# Altium schematic sheet llrf_afe_reserve_io.SchDoc: =GlobalProjectName
size 209 x 297 mm; SheetNumber: Лист; SheetTotal: Листов; PageSetup: Record=PageOptions|CenterHorizontal=True|CenterVertical=True|PrintScale=1.00|XCorrection=1.00|YCorrection=1.00|PrintKind=1|BorderSize=5000000|LeftOffset=0|BottomOffset=0|Orientation=2|PaperLength=1000|PaperWidth=1000|Scale=100|PaperSource=15|PrintQuality=1200|MediaType=1|DitherType=10|PaperKind=A3|PrintScaleMode=1; Weight: -; ScaleFactor: -
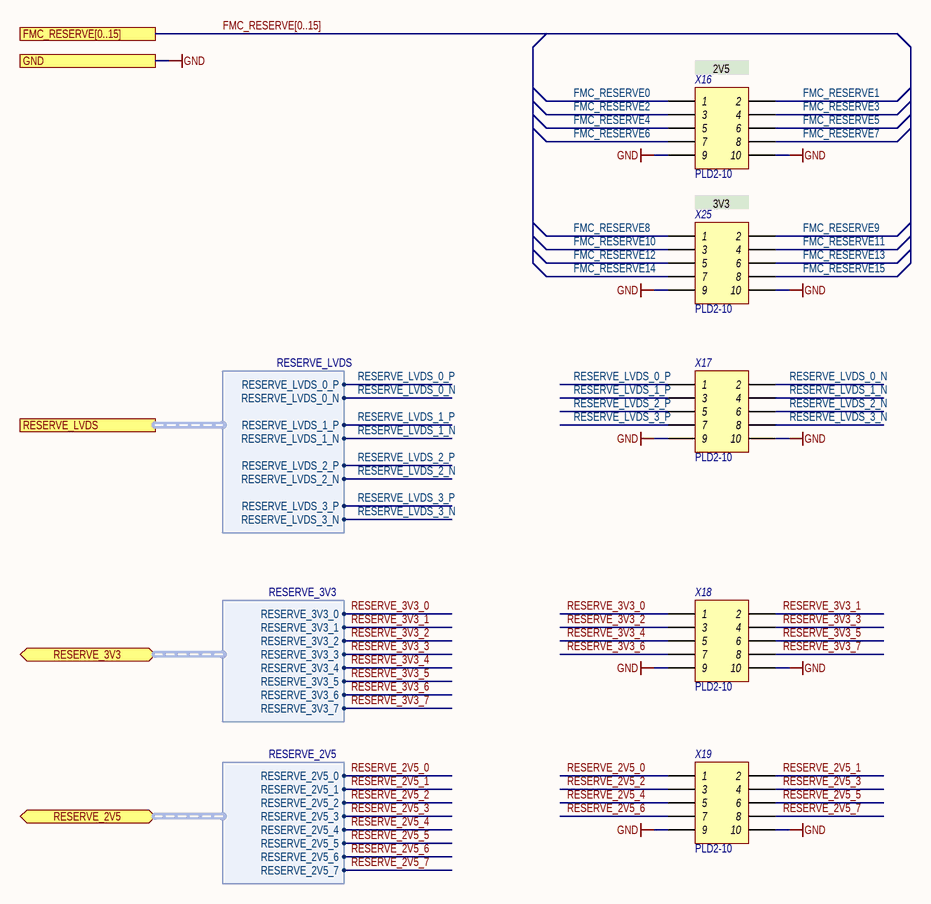
[diagram p0: llrf_afe_reserve_io.SchDoc]

## Parts
X16  Header 2X10  [PLD2-10]  (value not drawn)
X17  Header 2X10  [PLD2-10]  (value not drawn)
X18  Header 2X10  [PLD2-10]  (value not drawn)
X19  Header 2X10  [PLD2-10]  (value not drawn)
X25  Header 2X10  [PLD2-10]  (value not drawn)

## Ports
FMC_RESERVE[0..15], GND, RESERVE_2V5 (bidir, harness RESERVE_2V5), RESERVE_3V3 (bidir, harness RESERVE_3V3), RESERVE_LVDS (harness RESERVE_LVDS)

## Harnesses
RESERVE_LVDS: RESERVE_LVDS_0_P, RESERVE_LVDS_0_N, RESERVE_LVDS_1_P, RESERVE_LVDS_1_N, RESERVE_LVDS_2_P, RESERVE_LVDS_2_N, RESERVE_LVDS_3_P, RESERVE_LVDS_3_N
RESERVE_3V3: RESERVE_3V3_0, RESERVE_3V3_1, RESERVE_3V3_2, RESERVE_3V3_3, RESERVE_3V3_4, RESERVE_3V3_5, RESERVE_3V3_6, RESERVE_3V3_7
RESERVE_2V5: RESERVE_2V5_0, RESERVE_2V5_1, RESERVE_2V5_2, RESERVE_2V5_3, RESERVE_2V5_4, RESERVE_2V5_5, RESERVE_2V5_6, RESERVE_2V5_7

## Nets
GND: X16.9 X16.10 X17.9 X17.10 X18.9 X18.10 X19.9 X19.10 X25.9 X25.10 ; port GND
FMC_RESERVE0: X16.1
FMC_RESERVE1: X16.2
FMC_RESERVE2: X16.3
FMC_RESERVE3: X16.4
FMC_RESERVE4: X16.5
FMC_RESERVE5: X16.6
FMC_RESERVE6: X16.7
FMC_RESERVE7: X16.8
FMC_RESERVE8: X25.1
FMC_RESERVE9: X25.2
FMC_RESERVE10: X25.3
FMC_RESERVE11: X25.4
FMC_RESERVE12: X25.5
FMC_RESERVE13: X25.6
FMC_RESERVE14: X25.7
FMC_RESERVE15: X25.8
RESERVE_2V5_0: X19.1 ; port RESERVE_2V5.RESERVE_2V5_0
RESERVE_2V5_1: X19.2 ; port RESERVE_2V5.RESERVE_2V5_1
RESERVE_2V5_2: X19.3 ; port RESERVE_2V5.RESERVE_2V5_2
RESERVE_2V5_3: X19.4 ; port RESERVE_2V5.RESERVE_2V5_3
RESERVE_2V5_4: X19.5 ; port RESERVE_2V5.RESERVE_2V5_4
RESERVE_2V5_5: X19.6 ; port RESERVE_2V5.RESERVE_2V5_5
RESERVE_2V5_6: X19.7 ; port RESERVE_2V5.RESERVE_2V5_6
RESERVE_2V5_7: X19.8 ; port RESERVE_2V5.RESERVE_2V5_7
RESERVE_3V3_0: X18.1 ; port RESERVE_3V3.RESERVE_3V3_0
RESERVE_3V3_1: X18.2 ; port RESERVE_3V3.RESERVE_3V3_1
RESERVE_3V3_2: X18.3 ; port RESERVE_3V3.RESERVE_3V3_2
RESERVE_3V3_3: X18.4 ; port RESERVE_3V3.RESERVE_3V3_3
RESERVE_3V3_4: X18.5 ; port RESERVE_3V3.RESERVE_3V3_4
RESERVE_3V3_5: X18.6 ; port RESERVE_3V3.RESERVE_3V3_5
RESERVE_3V3_6: X18.7 ; port RESERVE_3V3.RESERVE_3V3_6
RESERVE_3V3_7: X18.8 ; port RESERVE_3V3.RESERVE_3V3_7
RESERVE_LVDS_0_N: X17.2 ; port RESERVE_LVDS.RESERVE_LVDS_0_N
RESERVE_LVDS_0_P: X17.1 ; port RESERVE_LVDS.RESERVE_LVDS_0_P
RESERVE_LVDS_1_N: X17.4 ; port RESERVE_LVDS.RESERVE_LVDS_1_N
RESERVE_LVDS_1_P: X17.3 ; port RESERVE_LVDS.RESERVE_LVDS_1_P
RESERVE_LVDS_2_N: X17.6 ; port RESERVE_LVDS.RESERVE_LVDS_2_N
RESERVE_LVDS_2_P: X17.5 ; port RESERVE_LVDS.RESERVE_LVDS_2_P
RESERVE_LVDS_3_N: X17.8 ; port RESERVE_LVDS.RESERVE_LVDS_3_N
RESERVE_LVDS_3_P: X17.7 ; port RESERVE_LVDS.RESERVE_LVDS_3_P

## Buses and harness runs
bus FMC_RESERVE[0..15] = port FMC_RESERVE[0..15]

## Notes on the sheet
- (near X16) 2V5
- 3V3
- Подп. и дата
- Инв. № дубл.
- Взам. инв. №
- Инв. № подл.
- Изм.
- Лист
- № докум.
- Подп.
- Дата
- Форма 2а ГОСТ 2.104-2006
- Копировал
- Формат А4

## Library data of the parts
X16-X19 X25 = Header 2X10: Header, 10-Pin, Dual row; Потребление, Вт: 0,0; Назначение: Header, 10-Pin, Dual row; Наименование: PLD2-10